# Altium schematic sheet DO.SchDoc
size A
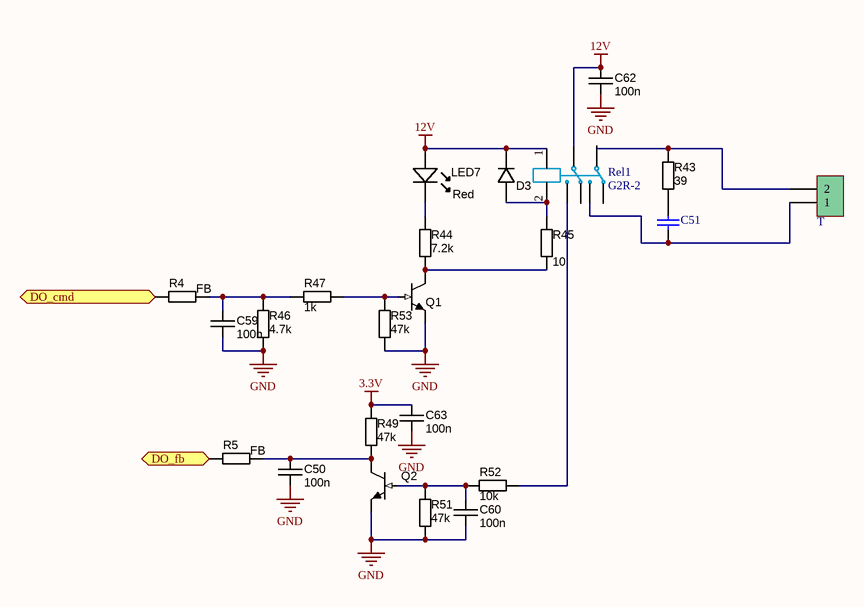
[diagram p0: DO.SchDoc]

## Parts
C50  100n  [CAPC1608X90N]
C51  (no value)  [CAP14MM]
C59  100n  [CAPC1608X90N]
C60  100n  [CAPC1608X90N]
C62  100n  [CAPC1608X90N]
C63  100n  [CAPC1608X90N]
D3  (no value)  [SOD80, LL-34]
LED7  value Red  [LED-0805-K]  (hidden comment: LED B)
Q1  (no value)  [SOT-23_N]
Q2  (no value)  [SOT-23_N]
R4  FB  [RESC1608X55N]
R5  FB  [RESC1608X55N]
R43  39  [RESTH_AXIAL-0.4]
R44  7.2k  [RESC1608X55N]
R45  10  [RESC3216X70N]
R46  4.7k  [RESC1608X55N]
R47  1k  [RESC1608X55N]
R49  47k  [RESC1608X55N]
R51  47k  [RESC1608X55N]
R52  10k  [RESC1608X55N]
R53  47k  [RESC1608X55N]
Rel1  G2R-2  [relay_G2R_2]
T  Phoenix terminal 2 pin  [phoenix terminal 2]  (value not drawn)

## Ports
DO_cmd (in), DO_fb (out)

## Nets
3.3V: C63.2 R49.2
12V: C62.2 D3.K LED7.A Rel1.1 Rel1.3
GND: C50.1 C59.1 C60.1 C62.1 C63.1 Q1.2(E) Q2.2(E) R46.1 R51.1 R53.1
DO_cmd: R4.1 ; port DO_cmd
DO_fb: R5.1 ; port DO_fb
NetC50_2: C50.2 Q2.3(C) R5.2 R49.1
NetC51_1: C51.1 R43.2
NetC51_2: C51.2 Rel1.7 T.1
NetC59_2: C59.2 R4.2 R46.2 R47.1
NetC60_2: C60.2 Q2.1(B) R51.2 R52.2
NetD3_A: D3.A R45.1 Rel1.2
NetLED7_K: LED7.K R44.1
NetQ1_1: Q1.1(B) R47.2 R53.2
NetQ1_3: Q1.3(C) R44.2 R45.2
NetR43_1: R43.1 Rel1.4 T.2
NetR52_1: R52.1 Rel1.5

Not connected (* = marked no-connect by the designer): Rel1 6 8

## Library data of the parts
C50 C59 C60 C62 C63 = CAPC_1n_0603_X7R_100V_10%: Capacitor 0603; Manufacturer 1: Murata Electronics North America; Manufacturer Part Number 1: GCM188R72A102KA37D; Tolerance: ±10%; Ratings: 100V; X7R; Material: ceramic; SCDType: spec; Package / Case: 0603 (1608 metric); Supplier 1: Digi-Key; Supplier Part Number 1: 490-4780-1-ND; Operating Temperature: -55°C ~ 125°C; Size / Dimension: 0.063" L x 0.031" W (1.60mm x 0.80mm); Thickness (Max): 0.035" (0.90mm); ComponentLink1URL: http://search.murata.co.jp/Ceramy/image/img/PDF/ENG/GCM188R72A102KA37.pdf; ComponentLink1Description: http://search.murata.co.jp/Ceramy/image/img/PDF/ENG/GCM188R72A102KA37.pdf; Value: 100n
C51 = Cap Semi: X1Y2 capacitor; Published: 8-Jun-2000; LatestRevisionDate: 29-May-2009; LatestRevisionNote: IPC-7351 Footprint Added.; PackageReference: C1206; Publisher: Altium Limited; PackageDescription: Chip Capacitor
D3 = DIODE_100V_500mW_MELF: 1n4148 minimelf; Manufacturer 1: Fairchild Semiconductor; Manufacturer Part Number 1: LL4148; Ratings: 100V; 150mA min; 500mW; Material: Si; Diode Type: Standard; Value: Vf=1V @ 10mA; SCDType: source; Package / Case: SOD80, LL-34; Manufacturer 2: DC Components; Manufacturer Part Number 2: DL4148; Supplier 1: Digi-Key; Supplier Part Number 1: LL4148FSCT-ND
LED7 = LED_SMD_Green_0805_6mcd: LED 0805 Red; Manufacturer 1: LITE-ON; Manufacturer Part Number 1: LTST-C171GKT; Material: GaP; Ratings: 6 mcd; 569 nm; SCDType: source; Color: Green; Package / Case: 0805; Supplier 1: Digi-Key; Supplier Part Number 1: 160-1423-1-ND
Q1 Q2 = NPN_MMBT2222A: BC817; Manufacturer 1: Fairchild Semiconductor; Ratings: 40V; 600mA; 250mW; Material: Si; SCDType: source; Package / Case: SOT-23; Mounting Type: Surface Mount; Supplier 1: Digi-Key; Supplier Part Number 1: MMBT2222AFSTR-ND; Manufacturer 2: NXP Semiconductors; Manufacturer Part Number 2: MMBT2222A; Manufacturer Part Number 1: MMBT2222A; Supplier 2: Digi-Key; Supplier Part Number 2: 568-4509-2-ND
R4 R5 R44 R46 R47 R49 R51-R53 = RES_2K2_0603_5%: Resistor 0603; Manufacturer 1: Yageo; Manufacturer Part Number 1: RC0603JR-072K2L; Ratings: 1/10 W; Tolerance: ±5%; SCDType: spec; Temperature Coefficient: ±100ppm/°C; Package / Case: 0603 (1608 metric); Material: Thick Film; Supplier 1: Digi-Key; Supplier Part Number 1: 311-2.2KGRDKR-ND; RoHS 1: RoHS Compliant; ComponentLink1URL: http://www.yageo.com/documents/recent/PYu-RC0603_51_RoHS_L_4.pdf; ComponentLink1Description: http://www.yageo.com/documents/recent/PYu-RC0603_51_RoHS_L_4.pdf; Supplier 2: Digi-Key; Supplier Part Number 2: 1276-5070-6-ND; Manufacturer 2: Samsung Electro-Mechanics America, Inc; Manufacturer Part Number 2: RC1608J222CS; RoHS 2: RoHS Compliant; ComponentLink2URL: http://www.samsungsem.com/servlet/FileDownload?filename=productcatalog/pdf/Chip_Resistor.pdf; ComponentLink2Description: http://www.samsungsem.com/servlet/FileDownload?filename=productcatalog/pdf/Chip_Resistor.pdf; Supplier 3: Digi-Key; Supplier Part Number 3: RMCF0603JT2K20DKR-ND; Manufacturer 3: Stackpole Electronics Inc; Manufacturer Part Number 3: RMCF0603JT2K20; RoHS 3: RoHS Compliant; ComponentLink3URL: http://www.seielect.com/Catalog/SEI-RMCF_RMCP.pdf; ComponentLink3Description: http://www.seielect.com/Catalog/SEI-RMCF_RMCP.pdf; Supplier 4: Digi-Key; Supplier Part Number 4: RHM2.2KCGDKR-ND; Manufacturer 4: Rohm Semiconductor; Manufacturer Part Number 4: MCR03ERTJ222; RoHS 4: RoHS Compliant; ComponentLink4URL: http://rohmfs.rohm.com/en/products/databook/datasheet/passive/resistor/chip_resistor/mcr_g.pdf; ComponentLink4Description: http://rohmfs.rohm.com/en/products/databook/datasheet/passive/resistor/chip_resistor/mcr_g.pdf; Supplier 5: Digi-Key; Supplier Part Number 5: P2.2KGDKR-ND; Manufacturer 5: Panasonic Electronic Components; Manufacturer Part Number 5: ERJ-3GEYJ222V; RoHS 5: RoHS Compliant; ComponentLink5URL: http://industrial.panasonic.com/www-cgi/jvcr13pz.cgi?E+PZ+3+AOA0001+ERJ3GEYJ222V+7+WW; ComponentLink5Description: http://industrial.panasonic.com/www-cgi/jvcr13pz.cgi?E+PZ+3+AOA0001+ERJ3GEYJ222V+7+WW
  R4 R5: Value: FB
  R44: Value: 7.2k
  R46: Value: 4.7k
  R47: Value: 1k
  R49 R51 R53: Value: 47k
  R52: Value: 10k
R43 = RES_1K5_Axial_0.5W_5%: Resistor .25w dip; Manufacturer 1: Yageo; Manufacturer Part Number 1: CFR-50JB-1K5; Tolerance: ±5%; Ratings: 1/2W; SCDType: spec; Package / Case: Axial; Supplier 1: Digi-Key; Supplier Part Number 1: 1.5KH-ND; Value: 39
R45 = RES_1R_1206_1%: Resistor 1206; Manufacturer 1: KOA Speer; Manufacturer Part Number 1: RK73H2BTTD1R00F; Ratings: 1/4W; 200V; Parameter Name: 100 PPM / C; SCDType: spec; Tolerance: ±1%; Package / Case: 1206 (3216 metric); Material: Thick Film; Supplier 1: Mouser; Supplier Part Number 1: 660-RK73H2BTTD1R00F; Value: 10
Rel1 = relay_G2R_2
T = Phoenix terminal 2: Terminal 2 Pin; Designer: Seyed Mohsen Ghasemain; E-mail: picpars@gmail.com; ComponentLinkURL: www.picpars.com